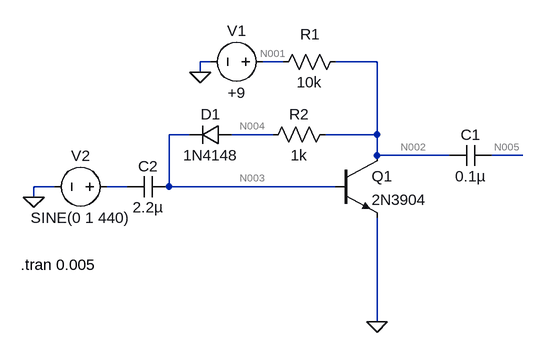
[diagram p0: schematic bazzfuss.asc]
bazzfuss.asc, the LTspice schematic file:
Version 4
SHEET 1 880 680
WIRE -64 -32 -80 -32
WIRE 48 -32 16 -32
WIRE 192 -32 128 -32
WIRE -80 -16 -80 -32
WIRE -96 80 -128 80
WIRE 32 80 -32 80
WIRE 192 80 192 -32
WIRE 192 80 112 80
WIRE 192 112 192 80
WIRE 304 112 192 112
WIRE 416 112 368 112
WIRE -304 160 -336 160
WIRE -192 160 -224 160
WIRE -128 160 -128 80
WIRE 128 160 -128 160
WIRE -336 176 -336 160
WIRE 192 368 192 208
FLAG 192 368 0
FLAG -80 -16 0
FLAG -336 176 0
SYMBOL npn 128 112 R0
SYMATTR InstName Q1
SYMATTR Value 2N3904
SYMBOL cap 368 96 R90
WINDOW 0 0 32 VBottom 2
WINDOW 3 32 32 VTop 2
SYMATTR InstName C1
SYMATTR Value 0.1µ
SYMBOL cap -128 144 R90
WINDOW 0 0 32 VBottom 2
WINDOW 3 32 32 VTop 2
SYMATTR InstName C2
SYMATTR Value 2.2µ
SYMBOL res 32 -16 R270
WINDOW 0 43 57 VTop 2
WINDOW 3 0 56 VBottom 2
SYMATTR InstName R1
SYMATTR Value 10k
SYMBOL diode -32 64 R90
WINDOW 0 0 32 VBottom 2
WINDOW 3 32 32 VTop 2
SYMATTR InstName D1
SYMATTR Value 1N4148
SYMBOL voltage 32 -32 R90
WINDOW 0 -32 56 VBottom 2
WINDOW 3 32 56 VTop 2
WINDOW 123 0 0 Left 2
WINDOW 39 0 0 Left 2
SYMATTR InstName V1
SYMATTR Value +9
SYMBOL voltage -208 160 R90
WINDOW 0 -32 56 VBottom 2
WINDOW 3 32 56 VTop 2
WINDOW 123 0 0 Left 2
WINDOW 39 0 0 Left 2
SYMATTR InstName V2
SYMATTR Value SINE(0 1 440)
SYMBOL res 128 64 R90
WINDOW 0 0 56 VBottom 2
WINDOW 3 32 56 VTop 2
SYMATTR InstName R2
SYMATTR Value 1k
TEXT -356 280 Left 2 !.tran 0.005

The netlist it stands for:
* bazzfuss.asc
Q1 N002 N003 0 0 2N3904
C1 N005 N002 0.1µ
C2 N003 N006 2.2µ
R1 N001 N002 10k
D1 N004 N003 1N4148
V1 N001 0 +9
V2 N006 0 SINE(0 1 440)
R2 N002 N004 1k
.model D D
.lib standard.dio
.model NPN NPN
.model PNP PNP
.lib standard.bjt
.tran 0.005
.backanno
.end

* Results of the author's LTspice run, read from the files saved beside the schematic
* Operating Point, zero values left out:
*   V(n002) = 967.7 mV
*   V(n003) = 649.5 mV
*   V(n005) = 96.77 nV
*   V(n001) = 9 V
*   V(n004) = 965.1 mV
*   Ic(Q1) = 800.6 µA
*   Ib(Q1) = 2.665 µA
*   Ie(Q1) = -803.2 µA
*   I(D1) = 2.665 µA
*   I(R2) = 2.665 µA
*   I(R1) = 803.2 µA
*   I(V1) = -803.2 µA
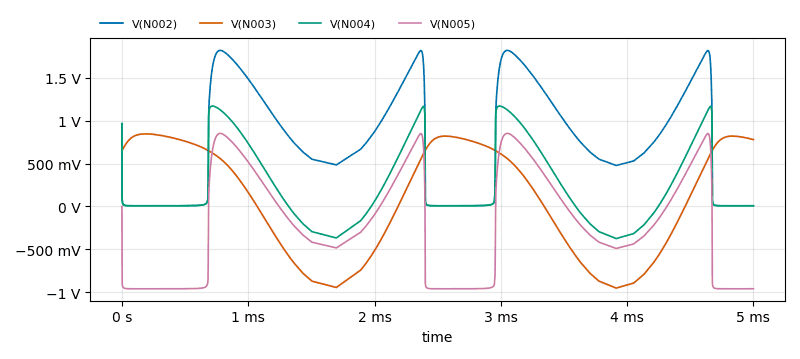
[diagram p1: Transient Analysis of bazzfuss.asc, plotted from the saved traces]
* Transient Analysis, 1 run:
*   V(N002): min 7.775 mV, max 1.82 V, average 746.3 mV, rms 971.8 mV, last 8.142 mV
*   V(N003): min -951.6 mV, max 846.5 mV, average 62.81 mV, rms 654.6 mV, last 779.5 mV
*   V(N004): min -374.2 mV, max 1.171 V, average 215.8 mV, rms 502.4 mV, last 8.137 mV
*   V(N005): min -960 mV, max 852.2 mV, average -221.4 mV, rms 660.6 mV, last -959.6 mV